# EAGLE design modul_przedwzmacniacza (EAGLE 7.7.0)
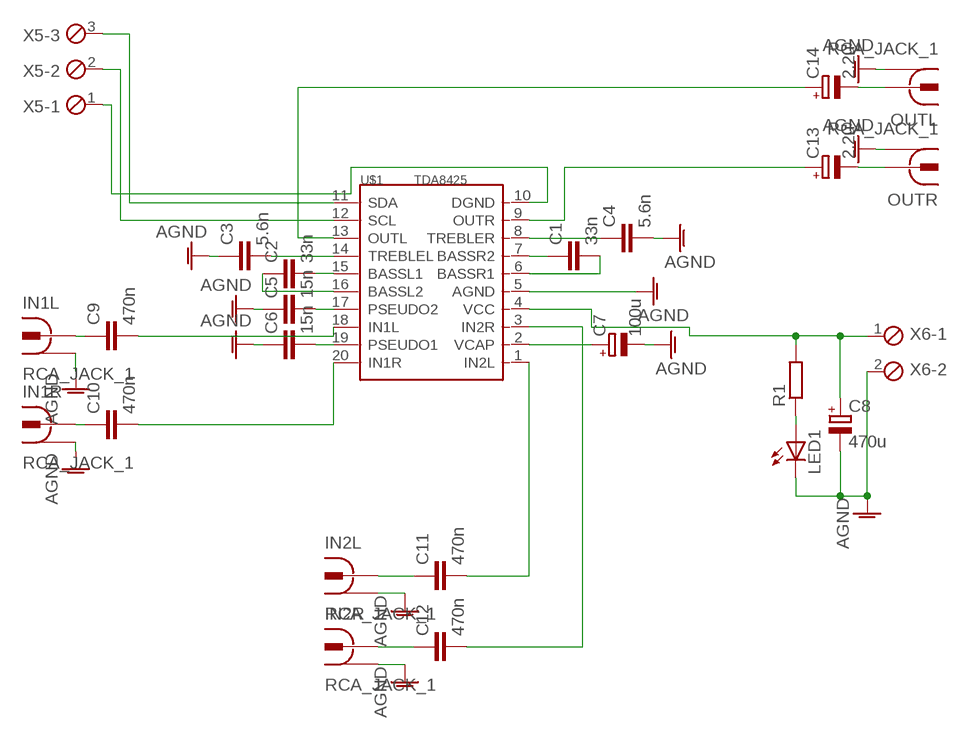
[diagram p0: schematic, sheet 1]

## Parts
C1  33n  C-EU050-025X075  [C050-025X075]
C2  33n  C-EU050-025X075  [C050-025X075]
C3  5.6n  C-EU050-030X075  [C050-030X075]
C4  5.6n  C-EU050-030X075  [C050-030X075]
C5  15n  C-EU050-025X075  [C050-025X075]
C6  15n  C-EU050-025X075  [C050-025X075]
C7  100u  CPOL-EUE2.5-6  [E2,5-6]
C8  470u  CPOL-EUE3.5-8  [E3,5-8]
C9  470n  C-EU050-045X075  [C050-045X075]
C10  470n  C-EU050-045X075  [C050-045X075]
C11  470n  C-EU050-045X075  [C050-045X075]
C12  470n  C-EU050-045X075  [C050-045X075]
C13  2.2u  CPOL-EUE2-4  [E2-4]
C14  2.2u  CPOL-EUE2-4  [E2-4]
IN1L  RCA_JACK_1  [736880-50]
IN1R  RCA_JACK_1  [736880-50]
IN2L  RCA_JACK_1  [736880-50]
IN2R  RCA_JACK_1  [736880-50]
LED1  LED3MM  [LED3MM]
OUTL  RCA_JACK_1  [736880-50]
OUTR  RCA_JACK_1  [736880-50]
R1  R-EU_R1206  [R1206]
U$1  TDA8425  [DIP20-2.54-26.2X7.62MM]
X5  MPT3  [3POL254]
X6  MPT2  [2POL254]

## Nets
AGND: C3.1 C4.2 C5.1 C6.1 C7.- C8.- IN1L.1 IN1R.1 IN2L.1 IN2R.1 LED1.K(C) OUTL.1 OUTR.1 U$1.5(AGND) X6.2
DGND: U$1.10(DGND) X5.1
IN2R: C12.2 U$1.3(IN2R)
N$1: C11.2 U$1.1(IN2L)
N$2: C9.2 U$1.18(IN1L)
N$3: C10.2 U$1.20(IN1R)
N$4: C9.1 IN1L.2
N$5: C10.1 IN1R.2
N$6: C11.1 IN2L.2
N$7: C1.1 U$1.7(BASSR2)
N$8: C1.2 U$1.6(BASSR1)
N$9: C2.2 U$1.15(BASSL1)
N$10: C2.1 U$1.16(BASSL2)
N$11: C3.2 U$1.14(TREBLEL)
N$12: C4.1 U$1.8(TREBLER)
N$13: C5.2 U$1.17(PSEUDO2)
N$14: C6.2 U$1.19(PSEUDO1)
N$15: C7.+ U$1.2(VCAP)
N$16: C12.1 IN2R.2
N$17: C13.+ U$1.9(OUTR)
N$18: C13.- OUTR.2
N$19: C14.- OUTL.2
N$20: LED1.A R1.1
OUTL: C14.+ U$1.13(OUTL)
SCL: U$1.12(SCL) X5.2
SDA: U$1.11(SDA) X5.3
VCC: C8.+ R1.2 U$1.4(VCC) X6.1

## Library data of the parts
C1-C6 C9-C12 = rcl:C-EU: CAPACITOR, European symbol
C7 C8 C13 C14 = rcl:CPOL-EU: POLARIZED CAPACITOR, European symbol
IN1L IN1R IN2L IN2R OUTL OUTR = my_electronics_library:RCA_JACK_1: Cinch Connector ( RCA Jack ) Cinch-Einbaukupplung 90º 72345 Vernickelt BKL Electronic Source: Conrad <http://www.conrad.de/ce/de/product/736880>
LED1 = led:LED: LED OSRAM: - CHIPLED LG R971, LG N971, LY N971, LG Q971, LY Q971, LO R971, LY R971 LH N974, LH R974 LS Q976, LO Q976, LY Q976 LO Q996 - Hyper CHIPLED LW Q18S LB Q993, LB Q99A, LB R99A - SideLED LS A670, LO A670, LY A670, LG A670, LP A670 LB A673, LV A673, LT A673, LW A673 LH A674 LY A675 LS A676, LA A676, LO A676, LY A676, LW A676 LS A679, LY A679, LG A679 - Hyper Micro SIDELED® LS Y876, LA Y876, LO Y876, LY Y876 LT Y87S - SmartLED LW L88C, LW L88S LB L89C, LB L89S, LG L890 LS L89K, LO L89K, LY L89K LS L896, LA L896, LO L896, LY L896 - TOPLED LS T670, LO T670, LY T670, LG T670, LP T670 LSG T670, LSP T670, LSY T670, LOP T670, LYG T670 LG T671, LOG T671, LSG T671 LB T673, LV T673, LT T673, LW T673 LH T674 LS T676, LA T676, LO T676, LY T676, LB T676, LH T676, LSB T676, LW T676 LB T67C, LV T67C, LT T67C, LS T67K, LO T67K, LY T67K, LW E67C LS E67B, LA E67B, LO E67B, LY E67B, LB E67C, LV E67C, LT E67C LW T67C LS T679, LY T679, LG T679 LS T770, LO T770, LY T770, LG T770, LP T770 LB T773, LV T773, LT T773, LW T773 LH T774 LS E675, LA E675, LY E675, LS T675 LS T776, LA T776, LO T776, LY T776, LB T776 LHGB T686 LT T68C, LB T68C - Hyper Mini TOPLED® LB M676 - Mini TOPLED Santana® LG M470 LS M47K, LO M47K, LY M47K Source: http://www.osram.convergy.de LUXEON: - LUMILED® LXK2-PW12-R00, LXK2-PW12-S00, LXK2-PW14-U00, LXK2-PW14-V00 LXK2-PM12-R00, LXK2-PM12-S00, LXK2-PM14-U00 LXK2-PE12-Q00, LXK2-PE12-R00, LXK2-PE12-S00, LXK2-PE14-T00, LXK2-PE14-U00 LXK2-PB12-K00, LXK2-PB12-L00, LXK2-PB12-M00, LXK2-PB14-N00, LXK2-PB14-P00, LXK2-PB14-Q00 LXK2-PR12-L00, LXK2-PR12-M00, LXK2-PR14-Q00, LXK2-PR14-R00 LXK2-PD12-Q00, LXK2-PD12-R00, LXK2-PD12-S00 LXK2-PH12-R00, LXK2-PH12-S00 LXK2-PL12-P00, LXK2-PL12-Q00, LXK2-PL12-R00 Source: www.luxeon.com KINGBRIGHT: KA-3528ASYC Source: www.kingbright.com
R1 = rcl:R-EU_: RESISTOR, European symbol
U$1 = my_electronics_library:TDA8425
X5 = con-phoenix-254:MPT3: PHOENIX CONNECTOR; OC_FARNELL: unknown; OC_NEWARK: unknown
X6 = con-phoenix-254:MPT2: PHOENIX CONNECTOR; OC_FARNELL: unknown; OC_NEWARK: unknown

## Board
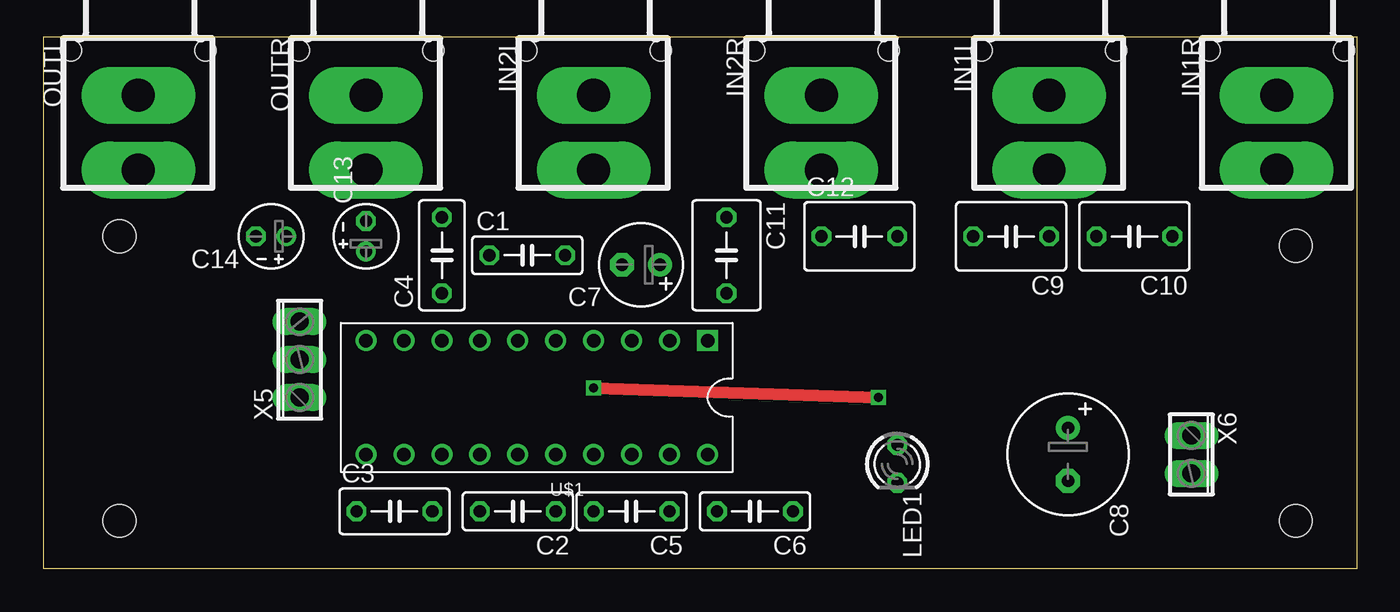
[diagram p1: board, top side]
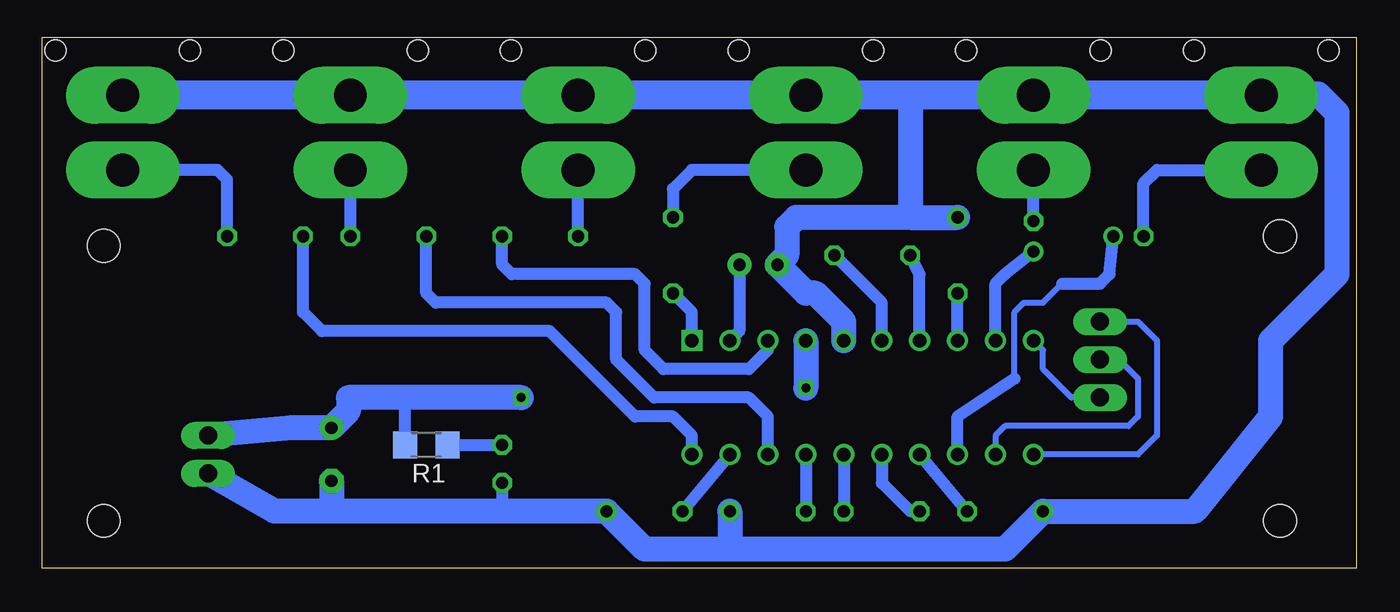
[diagram p2: board, bottom side, seen from below]

Size 87.94 x 35.55 mm. Coordinates in mm from the lower left corner, seen from the top.
Outline: 0,0 87.94,0 87.94,35.55 0,35.55 0,0
Copper layers (1*16): Top 0.035mm / dielectric 1.5mm / Bottom 0.035mm
Design rules "default": minimum track width 10mil, minimum drill 24mil, track to track 8mil, track to pad 8mil, pad to pad 8mil, via to via 8mil, smd to smd 8mil, copper to edge 40mil, drill to drill 8mil, minimum pad ring 10mil, minimum via ring 8mil, stop-mask expansion 4mil, vias tented up to drill 0mil, thermal gap 10mil
Holes 2.2 mm at 5.08,22.22 83.82,21.59 5.08,3.18 83.82,3.18

### Footprints (pad centres in the part's own frame; a part is rotated, then mirrored left to right if it is on the bottom)
C050-025X075 = drill 0.813 octagon: 1 -2.54,0; 2 2.54,0
C050-030X075 = drill 0.813 octagon: 1 -2.54,0; 2 2.54,0
E2,5-6 = drill 0.813 pad 1.6: + -1.27,0 | drill 0.813 pad 1.6 octagon: - 1.27,0
E3,5-8 = drill 0.813 pad 1.6: + -1.778,0 | drill 0.813 pad 1.6 octagon: - 1.778,0
C050-045X075 = drill 0.813 octagon: 1 -2.54,0; 2 2.54,0
E2-4 = drill 0.813 pad 1.27: + -1.016,0 | drill 0.813 pad 1.27 octagon: - 1.016,0
736880-50 = drill 2.2 pad 3.81 long: 1 -5,0; 2 0,0 | hole 1.4: -8,4.5; -8,-4.5
LED3MM = drill 0.813 octagon: A -1.27,0; K 1.27,0
R1206 = smd 1.6 x 1.803: 1 -1.422,0; 2 1.422,0
DIP20-2.54-26.2X7.62MM = drill 0.9 pad 1.4 square: 1 -11.43,-3.81 | drill 0.9 pad 1.4: 2 -8.89,-3.81; 3 -6.35,-3.81; 4 -3.81,-3.81; 5 -1.27,-3.81; 6 1.27,-3.81; 7 3.81,-3.81; 8 6.35,-3.81; 9 8.89,-3.81; 10 11.43,-3.81; 11 11.43,3.81; 12 8.89,3.81; 13 6.35,3.81; 14 3.81,3.81; 15 1.27,3.81; 16 -1.27,3.81; 17 -3.81,3.81; 18 -6.35,3.81; 19 -8.89,3.81; 20 -11.43,3.81
3POL254 = drill 1.2 long: 1 -2.54,0; 2 0,0; 3 2.54,0
2POL254 = drill 1.2 long: 1 -1.27,0; 2 1.27,0

### Placement (x,y rotation side)
C1  32.39,20.95 0 top
C2  31.75,3.81 180 top
C3  23.5,3.81 0 top
C4  26.67,20.95 90 top
C5  39.37,3.81 180 top
C6  47.62,3.81 180 top
C7  40,20.32 180 top
C8  68.58,7.62 270 top
C9  64.77,22.22 180 top
C10  73.02,22.22 180 top
C11  45.72,20.95 270 top
C12  54.61,22.22 0 top
C13  21.59,22.22 90 top
C14  15.24,22.22 180 top
IN1L  67.31,26.67 270 top
IN1R  82.55,26.67 270 top
IN2L  36.83,26.67 270 top
IN2R  52.07,26.67 270 top
LED1  57.15,6.98 270 top
OUTL  6.35,26.67 270 top
OUTR  21.59,26.67 270 top
R1  62.23,8.25 180 bottom
U$1  33.02,11.43 180 top
X5  17.14,13.97 90 top
X6  76.83,7.62 270 top

### Tracks (layer width: path | path; a pad name or v marks a point on that pad's centre or on a via)
AGND
  Bottom 0.813: LED1.K 57.15,3.81
  Bottom 1.676: 41.91,1.27 23.5,1.27 C3.1 10.8,3.81 5.71,10.16 5.71,15.24 1.27,19.68 1.27,30.48 2.54,31.75 6.9,31.75 OUTL.1 | C5.1 41.91,1.27 | 41.91,1.27 47.62,1.27 C6.1 57.15,3.81 68.58,3.81 | 68.58,3.81 72.39,3.81 X6.2 | C8.- 68.58,3.81 | 29.85,31.67 29.85,23.5 | 29.85,23.5 C4.2 | U$1.5 34.29,16.51 36.19,18.41 36.83,18.41 C7.- 38.1,20.95 38.1,22.86 37.47,23.5 29.85,23.5
  Bottom 1.93: OUTL.1 OUTR.1 29.85,31.67 IN2L.1 IN2R.1 IN1L.1 IN1R.1
DGND
  Bottom 0.406: X5.1 19.05,11.43 20.96,13.34 20.96,14.61 U$1.10
IN2R
  Bottom 0.813: U$1.3 39.37,14.61 40.64,13.34 46.36,13.34 47.62,14.61 47.62,19.05 48.26,19.68 56.52,19.68 57.15,20.32 C12.2
N$1
  Bottom 0.813: U$1.1 44.45,17.14 C11.2
N$2
  Bottom 0.813: U$1.18 39.37,10.16 40.64,11.43 46.99,11.43 49.53,13.97 49.53,17.14 50.17,17.78 61.59,17.78 62.23,18.41 C9.2
N$3
  Bottom 0.813: U$1.20 44.45,8.89 45.72,10.16 48.26,10.16 53.97,15.88 69.22,15.88 70.48,17.14 C10.2
N$4
  Bottom 0.813: C9.1 IN1L.2
N$5
  Bottom 0.813: C10.1 75.56,26.04 76.2,26.67 IN1R.2
N$6
  Bottom 0.813: IN2L.2 44.45,26.67 45.72,25.4 C11.1
N$7
  Bottom 0.813: U$1.7 29.21,19.68 C1.1
N$8
  Bottom 0.813: U$1.6 31.75,17.78 C1.2
N$9
  Bottom 0.813: U$1.15 31.75,5.71 29.85,3.81 C2.2
N$10
  Bottom 0.813: U$1.16 C2.1
N$11
  Bottom 0.813: U$1.14 C3.2
N$12
  Bottom 0.813: U$1.8 C4.1
N$13
  Bottom 0.813: U$1.17 C5.2
N$14
  Bottom 0.813: U$1.19 C6.2
N$15
  Bottom 0.813: C7.+ 41.28,15.88 U$1.2
N$16
  Bottom 0.813: C12.1 IN2R.2
N$17
  Bottom 0.813: U$1.9 24.13,19.05 23.5,19.68 C13.+
N$18
  Bottom 0.813: C13.- OUTR.2
N$19
  Bottom 0.813: C14.- 14.22,25.78 13.34,26.67 OUTL.2
N$20
  Bottom 0.813: R1.1 LED1.A
OUTL
  Bottom 0.406: 22.86,12.7 22.86,17.14 22.23,17.78 20.96,17.78 19.68,19.05
  Bottom 0.813: U$1.13 26.67,10.16 22.86,12.7 | 19.68,19.05 17.78,19.05 17.14,19.05 16.51,19.68 C14.+
SCL
  Bottom 0.406: X5.2 15.88,13.97 14.61,12.7 14.61,10.16 15.24,9.52 23.5,9.52 24.13,8.89 U$1.12
SDA
  Bottom 0.406: X5.3 14.61,16.51 13.34,15.24 13.34,8.89 14.61,7.62 U$1.11
VCC  (via drill 0.6)
  Top 0.813: v36.83,12.07 v55.88,11.43
  Bottom 0.813: R1.2 63.65,11.28 63.5,11.43
  Bottom 1.676: U$1.4 v36.83,12.07 | v55.88,11.43 63.5,11.43 67.44,11.43 67.44,10.54 C8.+ 71.25,9.4 X6.1